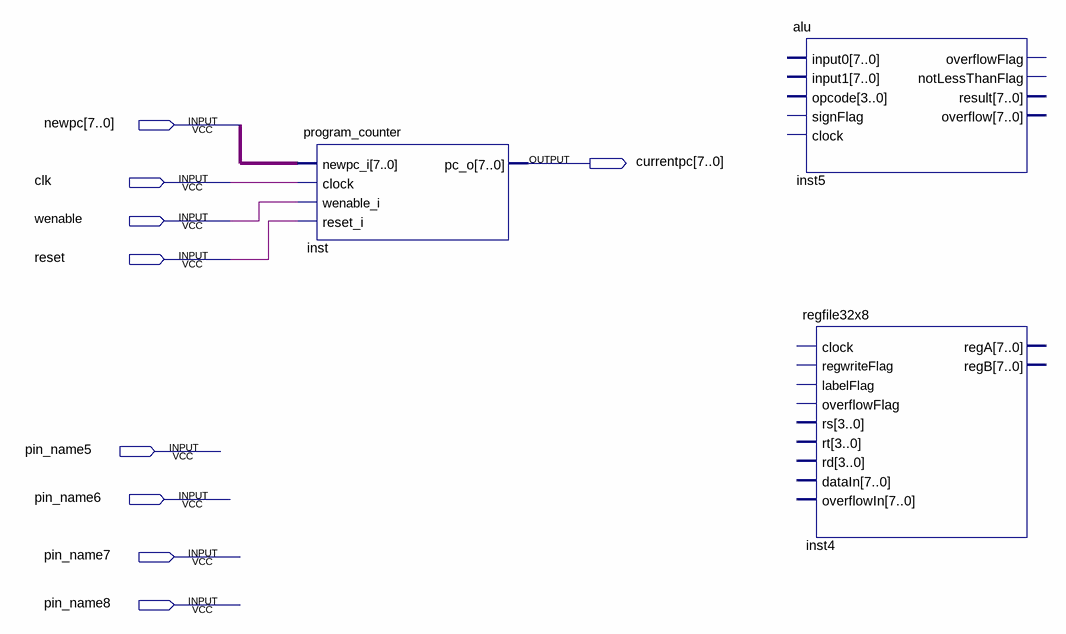
[diagram p0: schematic sheet]
// Quartus schematic CS141L.bdf as structural Verilog: 3 symbols, 9 pins
module CS141L (
  input  [7:0] newpc,
  input  clk,
  input  wenable,
  input  reset,
  input  pin_name5,
  input  pin_name6,
  input  pin_name7,
  input  pin_name8,
  output [7:0] currentpc
);

  program_counter inst (.newpc_i(newpc), .clock(clk), .wenable_i(wenable), .reset_i(reset), .pc_o(currentpc));
  alu inst5 ();  // open: input0, input1, opcode, signFlag, clock, overflowFlag, notLessThanFlag, result, overflow
  regfile32x8 inst4 ();  // open: clock, regwriteFlag, labelFlag, overflowFlag, rs, rt, rd, dataIn, overflowIn, regA, regB
endmodule
